# Altium schematic sheet mcu_peripheral.SchDoc
size A4; SheetNumber: 5; SheetTotal: 6
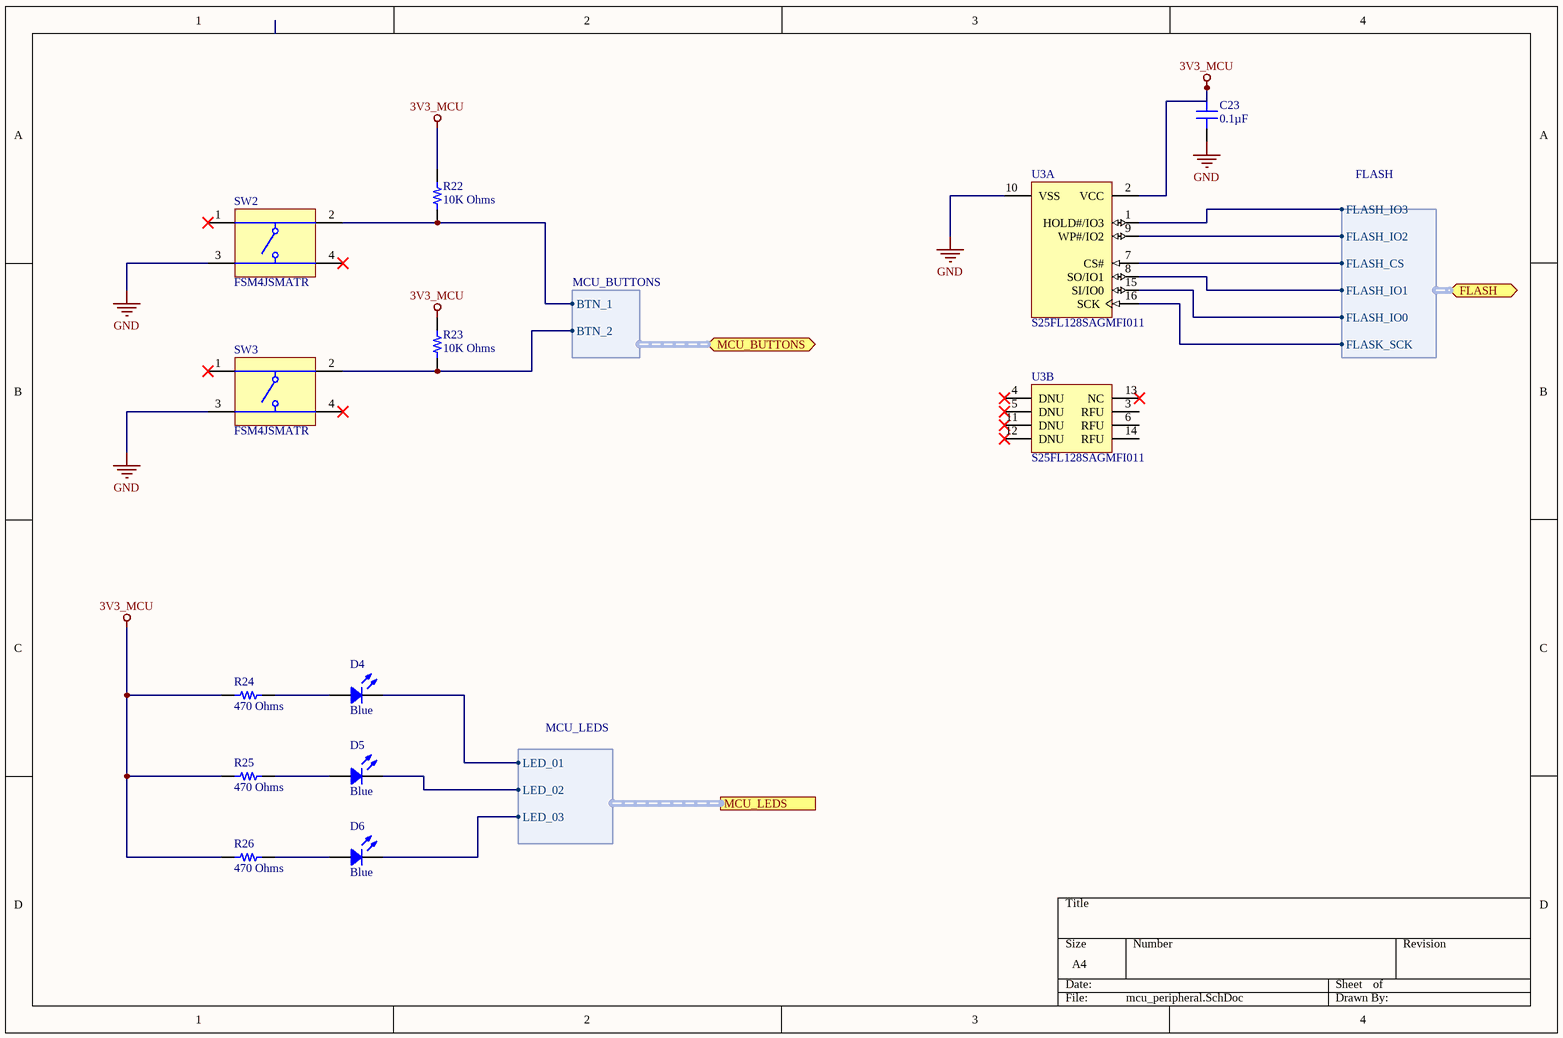
[diagram p0: mcu_peripheral.SchDoc]

## Parts
C23  0.1µF  [CAP 0603_1608]
D4  Blue  [LED 0603_1608 BLUE]
D5  Blue  [LED 0603_1608 BLUE]
D6  Blue  [LED 0603_1608 BLUE]
R22  10K Ohms  [RES 0603_1608]
R23  10K Ohms  [RES 0603_1608]
R24  470 Ohms  [RES 0603_1608]
R25  470 Ohms  [RES 0603_1608]
R26  470 Ohms  [RES 0603_1608]
SW2  FSM4JSMATR  [TECO-FSM4JSMATR_V]
SW3  FSM4JSMATR  [TECO-FSM4JSMATR_V]
U3  S25FL128SAGMFI011  [SPSN-SOIC-16_L]  (parts A,B of 2)

## Ports
FLASH (bidir, harness FLASH), MCU_BUTTONS (bidir, harness MCU_BUTTONS), MCU_LEDS (harness MCU_LEDS)

## Harnesses
MCU_LEDS: LED_01, LED_02, LED_03
FLASH: FLASH_IO3, FLASH_IO2, FLASH_CS, FLASH_IO1, FLASH_IO0, FLASK_SCK
MCU_BUTTONS: BTN_1, BTN_2

## Nets
3V3_MCU: C23.2 R22.2 R23.2 R24.1 R25.1 R26.1 U3.2(VCC)
GND: C23.1 SW2.3 SW3.3 U3.10(VSS)
NetD4_1: D4.1 R24.2
NetD4_2: D4.2 ; port MCU_LEDS.LED_01
NetD5_1: D5.1 R25.2
NetD5_2: D5.2 ; port MCU_LEDS.LED_02
NetD6_1: D6.1 R26.2
NetD6_2: D6.2 ; port MCU_LEDS.LED_03
NetR22_1: R22.1 SW2.2 ; port MCU_BUTTONS.BTN_1
NetR23_1: R23.1 SW3.2 ; port MCU_BUTTONS.BTN_2
NetU3_1: U3.1(HOLD#/IO3) ; port FLASH.FLASH_IO3
NetU3_7: U3.7(CS#) ; port FLASH.FLASH_CS
NetU3_8: U3.8(SO/IO1) ; port FLASH.FLASH_IO1
NetU3_9: U3.9(WP#/IO2) ; port FLASH.FLASH_IO2
NetU3_15: U3.15(SI/IO0) ; port FLASH.FLASH_IO0
NetU3_16: U3.16(SCK) ; port FLASH.FLASK_SCK

Not connected (* = marked no-connect by the designer): SW2 1* 4*; SW3 1* 4*; U3 3(RFU) 4(DNU)* 5(DNU)* 6(RFU) 11(DNU)* 12(DNU)* 13(NC)* 14(RFU)

## Library data of the parts
C23 = C0603C104K5RAC7411: CAP CER 0.1UF 50V X7R 0603; Manufacturer: KEMET; Tolerance: ±10%; Part Number: C0603C104K5RAC7411; Value: 0.1µF; Applications: Bypass, Decoupling; Capacitance: 0.1µF; ComponentLink1Description: Datasheet; ComponentLink1URL: https://api.kemet.com/component-edge/download/datasheet/C0603C104K5RAC7411.pdf; ComponentLink2Description: DigiKey Link; ComponentLink2URL: http://digikey.com/product-detail/en/kemet/C0603C104K5RAC7411/399-7374-2-ND/3317013; Device Package: 0603 (1608 Metric); LastUpdated: 02.09.2020 1:03:36; Lifecycle Status: Active; Minimum Order: 15000; Mounting Type: Surface Mount, MLCC; Operating Temperature: -55°C ~ 125°C; Package / Case: 0603 (1608 Metric); Packaging: TapeAndReel; PartId: 2233; Part Status: Active; Price: 0.02; Series: SMD Comm X7R; Size / Dimension: 0.063" L x 0.031" W (1.60mm x 0.80mm); Supplier 1: DigiKey; Supplier Part Number 1: 399-7374-2-ND; Temperature Coefficient: X7R; Thickness (Max): 0.035" (0.90mm); Voltage - Rated: 50V
D4-D6 = VLMB1300-GS08: LED BLUE 0603 SMD; Manufacturer: Vishay Semiconductor Opto Division; Configuration: Standard; Current - Test: 20mA; Lens Color: 1.00mm; Lens Size: 1.10mm x 0.80mm; Lens Style: Rectangle with Flat Top; Millicandela Rating: 104mcd; Viewing Angle: 130°; Voltage - Forward (Vf) (Typ): 3.3V; Wavelength - Dominant: 470nm; Wavelength - Peak: 468nm; Part Number: VLMB1300-GS08; Color: Blue; ComponentLink1Description: Datasheet; ComponentLink1URL: http://www.vishay.com/docs/82437/vlmo1300.pdf; ComponentLink2Description: DigiKey Link; ComponentLink2URL: http://digikey.com/product-detail/en/vishay-semiconductor-opto-division/VLMB1300-GS08/VLMB1300-GS08CT-ND/3025485; Device Package: 0603 (1608 Metric); Height (Max): 1.00mm; LastUpdated: 02.09.2020 1:20:26; Lifecycle Status: Active; Minimum Order: 1; Mounting Type: Surface Mount; Package / Case: 0603 (1608 Metric); Packaging: TapeAndReel; PartId: 785; Part Status: Active; Price: 0.08; Series: CHIPLED; Size / Dimension: 1.60mm L x 0.80mm W; Supplier 1: DigiKey; Supplier Part Number 1: VLMB1300-GS08CT-ND; Supplier Device Package: 0603; Value: Blue
R22 R23 = CRCW0603470RJNEAHP: RES SMD 470 OHM 5% 1/4W 0603; Manufacturer: Vishay Dale; Power (Watts): 0.25W, 1/4W; Resistance: 470 Ohms; Temperature Coefficient: ±200ppm/°C; Part Number: CRCW0603470RJNEAHP; Value: 10K Ohms; ComponentLink1Description: Datasheet; ComponentLink1URL: http://www.vishay.com/docs/20043/crcwhpe3.pdf; ComponentLink2Description: DigiKey Link; ComponentLink2URL: http://digikey.com/product-detail/en/vishay-dale/CRCW0603470RJNEAHP/541-470SACT-ND/2222809; Composition: Thick Film; Device Package: 0603 (1608 Metric); Features: Automotive AEC-Q200, Pulse Withstanding; Height - Seated (Max): 0.022" (0.55mm); LastUpdated: 02.09.2020 1:09:49; Lifecycle Status: Active; Minimum Order: 1; Number of Terminations: 2; Operating Temperature: -55°C ~ 155°C; Package / Case: 0603 (1608 Metric); Packaging: TapeAndReel; PartId: 21320; Part Status: Active; Price: 0.02; Ratings: AEC-Q200; Series: CRCW-HP; Size / Dimension: 0.063" L x 0.033" W (1.60mm x 0.85mm); Supplier Device Package: 0603; Tolerance: ±5%; Supplier 1: Farnell; Supplier Part Number 1: 3495224
R24-R26 = CRCW0603470RJNEAHP: RES SMD 470 OHM 5% 1/4W 0603; Manufacturer: Vishay Dale; Power (Watts): 0.25W, 1/4W; Temperature Coefficient: ±200ppm/°C; Part Number: CRCW0603470RJNEAHP; Value: 470 Ohms; ComponentLink1Description: Datasheet; ComponentLink1URL: http://www.vishay.com/docs/20043/crcwhpe3.pdf; ComponentLink2Description: DigiKey Link; ComponentLink2URL: http://digikey.com/product-detail/en/vishay-dale/CRCW0603470RJNEAHP/541-470SACT-ND/2222809; Composition: Thick Film; Device Package: 0603 (1608 Metric); Features: Automotive AEC-Q200, Pulse Withstanding; Height - Seated (Max): 0.022" (0.55mm); LastUpdated: 02.09.2020 1:09:49; Lifecycle Status: Active; Minimum Order: 1; Number of Terminations: 2; Operating Temperature: -55°C ~ 155°C; Package / Case: 0603 (1608 Metric); Packaging: TapeAndReel; PartId: 21320; Part Status: Active; Price: 0.02; Ratings: AEC-Q200; Resistance: 470 Ohms; Series: CRCW-HP; Size / Dimension: 0.063" L x 0.033" W (1.60mm x 0.85mm); Supplier 1: DigiKey; Supplier Part Number 1: 541-470SACT-ND; Supplier Device Package: 0603; Tolerance: ±5%
SW2 SW3 = CMP-2000-07486-1: Micro Miniature Push Button Switch FSM JSM, 50 mA, -35 to 85 degC, 4-Pin SMD, RoHS, Tape and Reel; Manufacturer: TE Connectivity; Mechanical Life: 100000Cycles; Current Rating: 50mA; Actuator Material: Polyamide; Max Voltage Rating (DC): 12V; Capacitance: 0f; Illumination Type: Illuminated; Voltage Rating (DC): 24V; Case\/Package: SMD/SMT; Operating Force: 160gf; Contact Resistance: 100mOhm; Actuator Length: 0.055inch; Switch Travel: 0.25mm; Throw Configuration: SPST; Termination: GullWing; Contact Plating: Silver; Orientation: Straight; Mounting Technology: SurfaceMount; REACH SVHC: Unknown; Electrical Life: 100000Cycles; Package Reference: FSM4JSMATR; Max Operating Temperature: 85degC; Manufacturer URL: http://www.te.com/; Package Description: 4-Pin Surface Mount Device, Body 6 x 6 mm, Pitch 4.5 mm; Datasheet Version: Rev. V, 02/2015; Packaging: TapeandReel; Min Operating Temperature: -35degC; Mount: SurfaceMount; Contact Current Rating: 50mA; Contact Material: CopperAlloy; Package Quantity: 1200; Datasheet URL: http://www.te.com/commerce/DocumentDelivery/DDEController?Action=showdoc&DocId=Customer+Drawing%7F2-1437565-7%7FV%7Fpdf%7FEnglish%7FENG_CD_2-1437565-7_V.pdf%7F4-1437565-2; RoHSCompliant: true
U3 = CMP-1329-00018-1: MirrorBit Flash Non-Volatile Memory CMOS 3.0 Volt Core with Versatile I/O, Serial Peripheral Interface with Multi-I/O, 128 Mbit, 133 MHz, -40 to 85 degC, 16-Pin SO (SO3016), RoHS, Tube; Manufacturer: Spansion; OTP: 1024 B; VCC: 2.7 to 3.6 V; Speed: 133 MHz; PackageDescription: 16-Pin Wide Plastic Small Outline Package, Body 10.3 x 7.5 mm, Pitch 1.27 mm; Density: 128 Mbit; ComponentLink3URL: http://www.spansion.com/Support/Datasheets/S25FL128S_256S_00.pdf; DatasheetVersion: Rev. 08; ComponentLink2Description: Datasheet; ComponentLink3Description: Package Specification; PartNumber: S25FL128SAGMFI011; ComponentLink1Description: Manufacturer URL; ComponentLink1URL: http://www.spansion.com/Pages/Default.aspx; Mounting Technology: Surface Mount; Temperature Range: -40 to 85 degC; ComponentLink2URL: http://www.spansion.com/Support/Datasheets/S25FL128S_256S_00.pdf; RoHS: TRUE; Packing: Tube